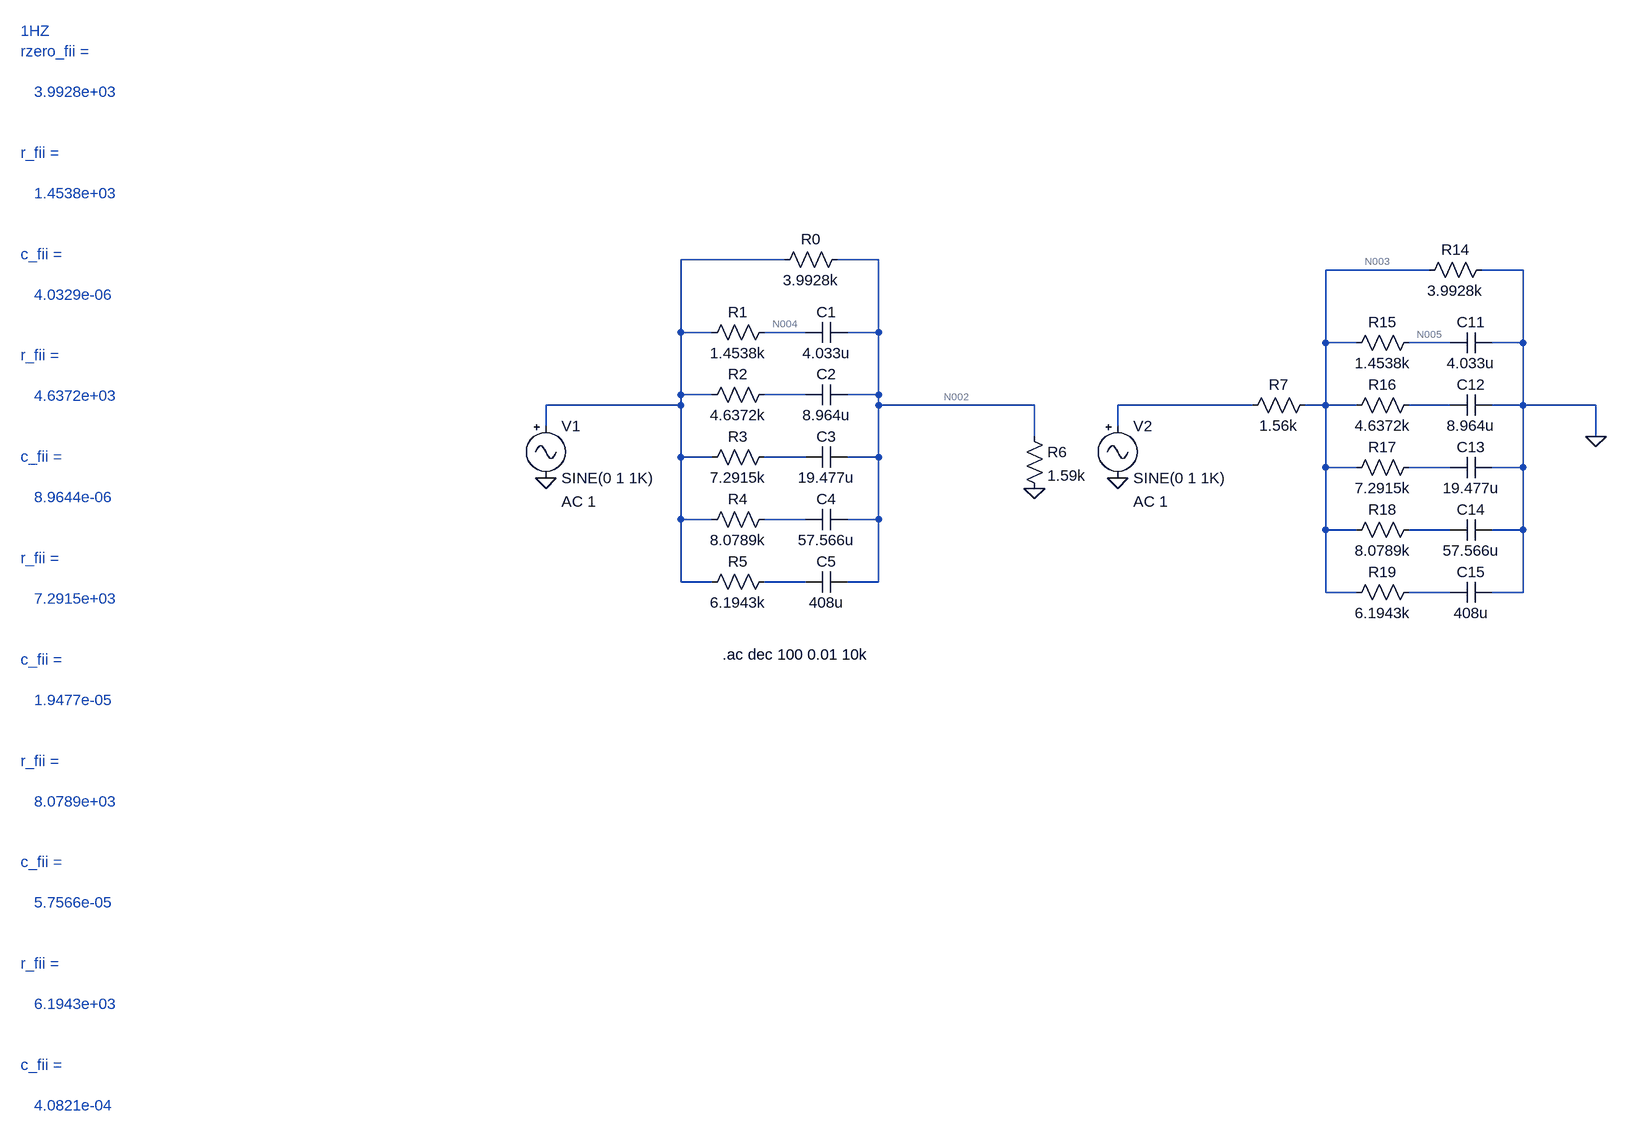
[diagram p0: schematic RC Ladder filter.asc]
RC Ladder filter.asc, the LTspice schematic file:
Version 4
SHEET 1 1204 1104
WIRE -176 -64 -336 -64
WIRE -32 -64 -96 -64
WIRE 816 -48 656 -48
WIRE 960 -48 896 -48
WIRE -336 48 -336 -64
WIRE -288 48 -336 48
WIRE -144 48 -208 48
WIRE -32 48 -32 -64
WIRE -32 48 -80 48
WIRE 656 64 656 -48
WIRE 704 64 656 64
WIRE 848 64 784 64
WIRE 960 64 960 -48
WIRE 960 64 912 64
WIRE -336 144 -336 48
WIRE -288 144 -336 144
WIRE -144 144 -208 144
WIRE -32 144 -32 48
WIRE -32 144 -80 144
WIRE -336 160 -336 144
WIRE -336 160 -544 160
WIRE -32 160 -32 144
WIRE 208 160 -32 160
WIRE 544 160 336 160
WIRE 656 160 656 64
WIRE 656 160 624 160
WIRE 704 160 656 160
WIRE 848 160 784 160
WIRE 960 160 960 64
WIRE 960 160 912 160
WIRE 1072 160 960 160
WIRE -544 192 -544 160
WIRE 336 192 336 160
WIRE 208 208 208 160
WIRE 1072 208 1072 160
WIRE -336 240 -336 160
WIRE -288 240 -336 240
WIRE -144 240 -208 240
WIRE -32 240 -32 160
WIRE -32 240 -80 240
WIRE 656 256 656 160
WIRE 704 256 656 256
WIRE 848 256 784 256
WIRE 960 256 960 160
WIRE 960 256 912 256
WIRE -336 336 -336 240
WIRE -288 336 -336 336
WIRE -144 336 -208 336
WIRE -32 336 -32 240
WIRE -32 336 -80 336
WIRE 656 352 656 256
WIRE 704 352 656 352
WIRE 848 352 784 352
WIRE 960 352 960 256
WIRE 960 352 912 352
WIRE -336 432 -336 336
WIRE -288 432 -336 432
WIRE -144 432 -208 432
WIRE -32 432 -32 336
WIRE -32 432 -80 432
WIRE 656 448 656 352
WIRE 704 448 656 448
WIRE 848 448 784 448
WIRE 960 448 960 352
WIRE 960 448 912 448
FLAG -544 272 0
FLAG 208 288 0
FLAG 336 272 0
FLAG 1072 208 0
SYMBOL res -80 -80 R90
WINDOW 0 0 56 VBottom 2
WINDOW 3 32 56 VTop 2
SYMATTR InstName R0
SYMATTR Value 3.9928k
SYMBOL res -192 32 R90
WINDOW 0 0 56 VBottom 2
WINDOW 3 32 56 VTop 2
SYMATTR InstName R1
SYMATTR Value 1.4538k
SYMBOL res -192 128 R90
WINDOW 0 0 56 VBottom 2
WINDOW 3 32 56 VTop 2
SYMATTR InstName R2
SYMATTR Value 4.6372k
SYMBOL res -192 224 R90
WINDOW 0 0 56 VBottom 2
WINDOW 3 32 56 VTop 2
SYMATTR InstName R3
SYMATTR Value 7.2915k
SYMBOL cap -80 32 R90
WINDOW 0 0 32 VBottom 2
WINDOW 3 32 32 VTop 2
SYMATTR InstName C1
SYMATTR Value 4.033u
SYMBOL cap -80 128 R90
WINDOW 0 0 32 VBottom 2
WINDOW 3 32 32 VTop 2
SYMATTR InstName C2
SYMATTR Value 8.964u
SYMBOL cap -80 224 R90
WINDOW 0 0 32 VBottom 2
WINDOW 3 32 32 VTop 2
SYMATTR InstName C3
SYMATTR Value 19.477u
SYMBOL cap -80 320 R90
WINDOW 0 0 32 VBottom 2
WINDOW 3 32 32 VTop 2
SYMATTR InstName C4
SYMATTR Value 57.566u
SYMBOL cap -80 416 R90
WINDOW 0 0 32 VBottom 2
WINDOW 3 32 32 VTop 2
SYMATTR InstName C5
SYMATTR Value 408u
SYMBOL res -192 320 R90
WINDOW 0 0 56 VBottom 2
WINDOW 3 32 56 VTop 2
SYMATTR InstName R4
SYMATTR Value 8.0789k
SYMBOL res -192 416 R90
WINDOW 0 0 56 VBottom 2
WINDOW 3 32 56 VTop 2
SYMATTR InstName R5
SYMATTR Value 6.1943k
SYMBOL Misc\\signal -544 176 R0
WINDOW 123 24 132 Left 2
WINDOW 39 0 0 Left 0
SYMATTR Value2 AC 1
SYMATTR InstName V1
SYMBOL res 192 192 R0
SYMATTR InstName R6
SYMATTR Value 1.59k
SYMBOL Misc\\signal 336 176 R0
WINDOW 123 24 132 Left 2
WINDOW 39 0 0 Left 0
SYMATTR Value2 AC 1
SYMATTR InstName V2
SYMBOL res 912 -64 R90
WINDOW 0 0 56 VBottom 2
WINDOW 3 32 56 VTop 2
SYMATTR InstName R14
SYMATTR Value 3.9928k
SYMBOL res 800 48 R90
WINDOW 0 0 56 VBottom 2
WINDOW 3 32 56 VTop 2
SYMATTR InstName R15
SYMATTR Value 1.4538k
SYMBOL res 800 144 R90
WINDOW 0 0 56 VBottom 2
WINDOW 3 32 56 VTop 2
SYMATTR InstName R16
SYMATTR Value 4.6372k
SYMBOL res 800 240 R90
WINDOW 0 0 56 VBottom 2
WINDOW 3 32 56 VTop 2
SYMATTR InstName R17
SYMATTR Value 7.2915k
SYMBOL cap 912 48 R90
WINDOW 0 0 32 VBottom 2
WINDOW 3 32 32 VTop 2
SYMATTR InstName C11
SYMATTR Value 4.033u
SYMBOL cap 912 144 R90
WINDOW 0 0 32 VBottom 2
WINDOW 3 32 32 VTop 2
SYMATTR InstName C12
SYMATTR Value 8.964u
SYMBOL cap 912 240 R90
WINDOW 0 0 32 VBottom 2
WINDOW 3 32 32 VTop 2
SYMATTR InstName C13
SYMATTR Value 19.477u
SYMBOL cap 912 336 R90
WINDOW 0 0 32 VBottom 2
WINDOW 3 32 32 VTop 2
SYMATTR InstName C14
SYMATTR Value 57.566u
SYMBOL cap 912 432 R90
WINDOW 0 0 32 VBottom 2
WINDOW 3 32 32 VTop 2
SYMATTR InstName C15
SYMATTR Value 408u
SYMBOL res 800 336 R90
WINDOW 0 0 56 VBottom 2
WINDOW 3 32 56 VTop 2
SYMATTR InstName R18
SYMATTR Value 8.0789k
SYMBOL res 800 432 R90
WINDOW 0 0 56 VBottom 2
WINDOW 3 32 56 VTop 2
SYMATTR InstName R19
SYMATTR Value 6.1943k
SYMBOL res 640 144 R90
WINDOW 0 0 56 VBottom 2
WINDOW 3 32 56 VTop 2
SYMATTR InstName R7
SYMATTR Value 1.56k
TEXT -1352 -416 Left 2 ;1HZ\nrzero_fii =\n \n   3.9928e+03\n \n \nr_fii =\n \n   1.4538e+03\n \n \nc_fii =\n \n   4.0329e-06\n \n \nr_fii =\n \n   4.6372e+03\n \n \nc_fii =\n \n   8.9644e-06\n \n \nr_fii =\n \n   7.2915e+03\n \n \nc_fii =\n \n   1.9477e-05\n \n \nr_fii =\n \n   8.0789e+03\n \n \nc_fii =\n \n   5.7566e-05\n \n \nr_fii =\n \n   6.1943e+03\n \n \nc_fii =\n \n   4.0821e-04
TEXT -272 544 Left 2 !.ac dec 100 0.01 10k

The netlist it stands for:
* RC Ladder filter.asc
R0 N002 N001 3.9928k
R1 N004 N001 1.4538k
R2 N006 N001 4.6372k
R3 N009 N001 7.2915k
C1 N002 N004 4.033u
C2 N002 N006 8.964u
C3 N002 N009 19.477u
C4 N002 N011 57.566u
C5 N002 N013 408u
R4 N011 N001 8.0789k
R5 N013 N001 6.1943k
V1 N001 0 SINE(0 1 1K) AC 1
R6 N002 0 1.59k
V2 N007 0 SINE(0 1 1K) AC 1
R14 0 N003 3.9928k
R15 N005 N003 1.4538k
R16 N008 N003 4.6372k
R17 N010 N003 7.2915k
C11 0 N005 4.033u
C12 0 N008 8.964u
C13 0 N010 19.477u
C14 0 N012 57.566u
C15 0 N014 408u
R18 N012 N003 8.0789k
R19 N014 N003 6.1943k
R7 N003 N007 1.56k
* 1HZ
* rzero_fii =
*    3.9928e+03
* r_fii =
*    1.4538e+03
* c_fii =
*    4.0329e-06
* r_fii =
*    4.6372e+03
* c_fii =
*    8.9644e-06
* r_fii =
*    7.2915e+03
* c_fii =
*    1.9477e-05
* r_fii =
*    8.0789e+03
* c_fii =
*    5.7566e-05
* r_fii =
*    6.1943e+03
* c_fii =
*    4.0821e-04
.ac dec 100 0.01 10k
.backanno
.end

* Results of the author's LTspice run, read from the files saved beside the schematic
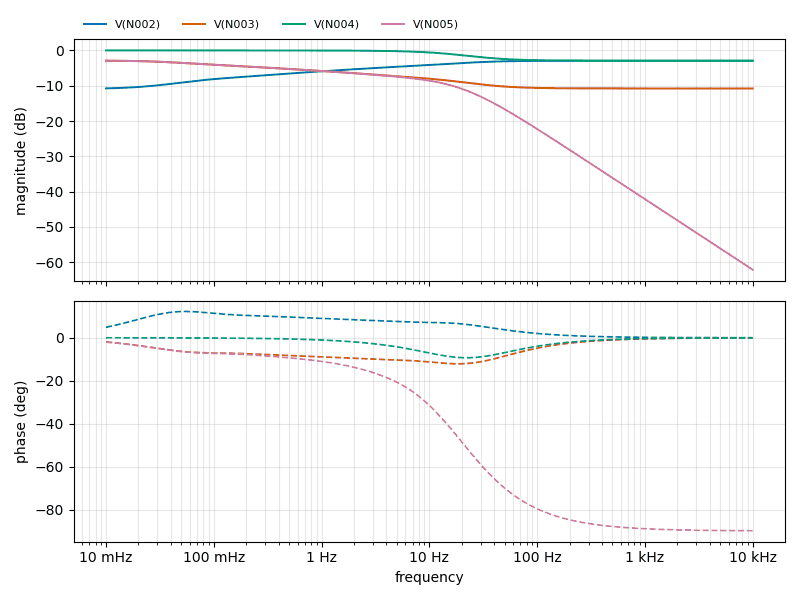
[diagram p1: AC Analysis of RC Ladder filter.asc, plotted from the saved traces]
* AC Analysis, 1 run:
*   V(N002): -10.75 dB at 10 mHz, -2.92 dB at 10 kHz, peak -2.92 dB at 10 kHz, 3 dB below the peak at 989.3 mHz
*   V(N003): -2.91 dB at 10 mHz, -10.78 dB at 10 kHz, peak -2.91 dB at 10 mHz, 3 dB below the peak at 1.114 Hz
*   V(N004): -0.00 dB at 10 mHz, -2.92 dB at 10 kHz, peak -0.00 dB at 10 mHz
*   V(N005): -2.91 dB at 10 mHz, -62.11 dB at 10 kHz, peak -2.91 dB at 10 mHz, 3 dB below the peak at 1.105 Hz